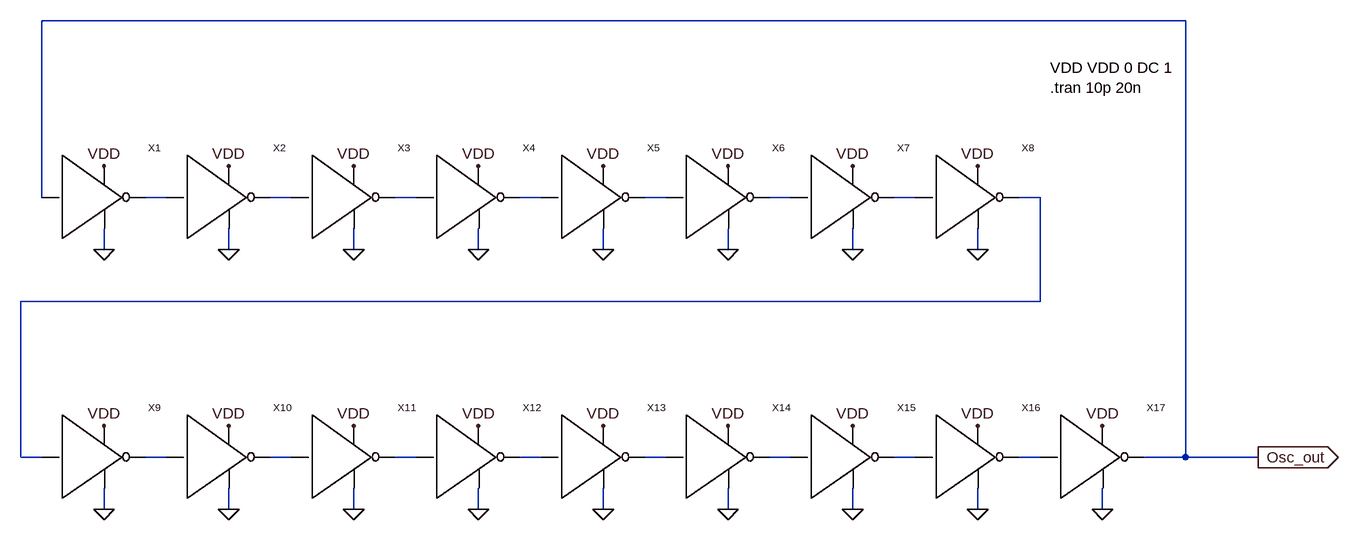
[diagram p0: schematic ring_osc.asc]
ring_osc.asc, the LTspice schematic file:
Version 4
SHEET 1 1960 680
WIRE 1680 -160 -80 -160
WIRE -80 112 -80 -160
WIRE 112 112 80 112
WIRE 304 112 272 112
WIRE 496 112 464 112
WIRE 688 112 656 112
WIRE 880 112 848 112
WIRE 1072 112 1040 112
WIRE 1264 112 1232 112
WIRE 1456 112 1424 112
WIRE 16 192 16 160
WIRE 208 192 208 160
WIRE 400 192 400 160
WIRE 592 192 592 160
WIRE 784 192 784 160
WIRE 976 192 976 160
WIRE 1168 192 1168 160
WIRE 1360 192 1360 160
WIRE 1456 272 1456 112
WIRE 1456 272 -112 272
WIRE -112 512 -112 272
WIRE -80 512 -112 512
WIRE 112 512 80 512
WIRE 304 512 272 512
WIRE 496 512 464 512
WIRE 688 512 656 512
WIRE 880 512 848 512
WIRE 1072 512 1040 512
WIRE 1264 512 1232 512
WIRE 1456 512 1424 512
WIRE 1680 512 1680 -160
WIRE 1680 512 1616 512
WIRE 1792 512 1680 512
WIRE 16 592 16 560
WIRE 208 592 208 560
WIRE 400 592 400 560
WIRE 592 592 592 560
WIRE 784 592 784 560
WIRE 976 592 976 560
WIRE 1168 592 1168 560
WIRE 1360 592 1360 560
WIRE 1552 592 1552 560
FLAG 16 192 0
FLAG 16 64 VDD
FLAG 208 192 0
FLAG 208 64 VDD
FLAG 400 192 0
FLAG 400 64 VDD
FLAG 592 192 0
FLAG 592 64 VDD
FLAG 784 192 0
FLAG 784 64 VDD
FLAG 976 192 0
FLAG 976 64 VDD
FLAG 1168 192 0
FLAG 1168 64 VDD
FLAG 1360 192 0
FLAG 1360 64 VDD
FLAG 16 592 0
FLAG 16 464 VDD
FLAG 208 592 0
FLAG 208 464 VDD
FLAG 400 592 0
FLAG 400 464 VDD
FLAG 592 592 0
FLAG 592 464 VDD
FLAG 784 592 0
FLAG 784 464 VDD
FLAG 976 592 0
FLAG 976 464 VDD
FLAG 1168 592 0
FLAG 1168 464 VDD
FLAG 1360 592 0
FLAG 1360 464 VDD
FLAG 1552 592 0
FLAG 1552 464 VDD
FLAG 1792 512 Osc_out
IOPIN 1792 512 Out
SYMBOL my_inverter -48 112 R0
SYMATTR InstName X1
SYMBOL my_inverter 144 112 R0
SYMATTR InstName X2
SYMBOL my_inverter 336 112 R0
SYMATTR InstName X3
SYMBOL my_inverter 528 112 R0
SYMATTR InstName X4
SYMBOL my_inverter 720 112 R0
SYMATTR InstName X5
SYMBOL my_inverter 912 112 R0
SYMATTR InstName X6
SYMBOL my_inverter 1104 112 R0
SYMATTR InstName X7
SYMBOL my_inverter 1296 112 R0
SYMATTR InstName X8
SYMBOL my_inverter -48 512 R0
SYMATTR InstName X9
SYMBOL my_inverter 144 512 R0
SYMATTR InstName X10
SYMBOL my_inverter 336 512 R0
SYMATTR InstName X11
SYMBOL my_inverter 528 512 R0
SYMATTR InstName X12
SYMBOL my_inverter 720 512 R0
SYMATTR InstName X13
SYMBOL my_inverter 912 512 R0
SYMATTR InstName X14
SYMBOL my_inverter 1104 512 R0
SYMATTR InstName X15
SYMBOL my_inverter 1296 512 R0
SYMATTR InstName X16
SYMBOL my_inverter 1488 512 R0
SYMATTR InstName X17
TEXT 1472 -88 Left 2 !VDD VDD 0 DC 1\n.tran 10p 20n

The netlist it stands for:
* ring_osc.asc
XX1 Osc_out N001 VDD 0 my_inverter  ; pins In Out VDD DGND
XX2 N001 N002 VDD 0 my_inverter  ; pins In Out VDD DGND
XX3 N002 N003 VDD 0 my_inverter  ; pins In Out VDD DGND
XX4 N003 N004 VDD 0 my_inverter  ; pins In Out VDD DGND
XX5 N004 N005 VDD 0 my_inverter  ; pins In Out VDD DGND
XX6 N005 N006 VDD 0 my_inverter  ; pins In Out VDD DGND
XX7 N006 N007 VDD 0 my_inverter  ; pins In Out VDD DGND
XX8 N007 N008 VDD 0 my_inverter  ; pins In Out VDD DGND
XX9 N008 N009 VDD 0 my_inverter  ; pins In Out VDD DGND
XX10 N009 N010 VDD 0 my_inverter  ; pins In Out VDD DGND
XX11 N010 N011 VDD 0 my_inverter  ; pins In Out VDD DGND
XX12 N011 N012 VDD 0 my_inverter  ; pins In Out VDD DGND
XX13 N012 N013 VDD 0 my_inverter  ; pins In Out VDD DGND
XX14 N013 N014 VDD 0 my_inverter  ; pins In Out VDD DGND
XX15 N014 N015 VDD 0 my_inverter  ; pins In Out VDD DGND
XX16 N015 N016 VDD 0 my_inverter  ; pins In Out VDD DGND
XX17 N016 Osc_out VDD 0 my_inverter  ; pins In Out VDD DGND
VDD VDD 0 DC 1
.tran 10p 20n
.backanno
.end